# Altium schematic sheet Input Cover Flex.SchDoc
size B
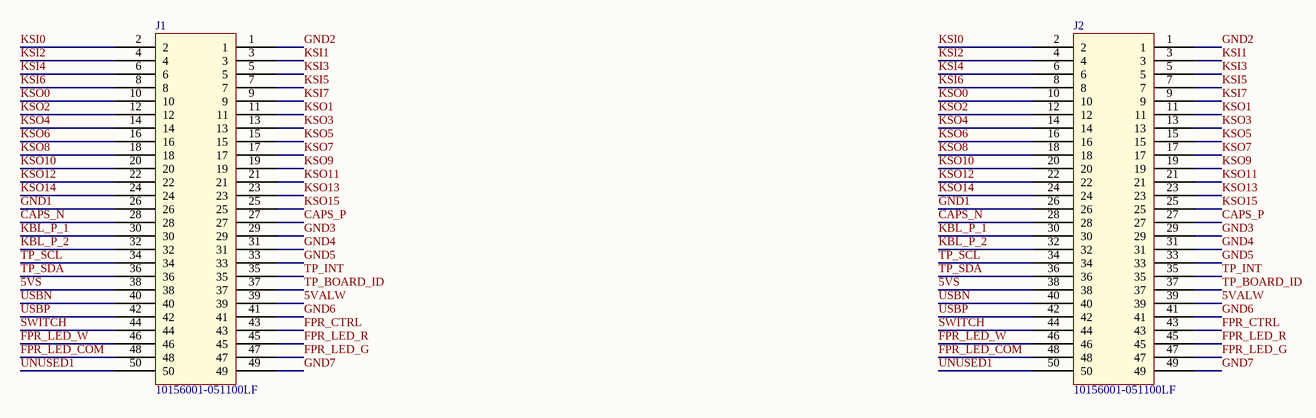
[diagram p0: Input Cover Flex.SchDoc]

## Parts
J1  10156001-051100LF  [10156001-051100LF]
J2  10156001-051100LF  [10156001-051100LF]

## Nets
5VALW: J1.39 J2.39
5VS: J1.38 J2.38
CAPS_N: J1.28 J2.28
CAPS_P: J1.27 J2.27
FPR_CTRL: J1.43 J2.43
FPR_LED_COM: J1.48 J2.48
FPR_LED_G: J1.47 J2.47
FPR_LED_R: J1.45 J2.45
FPR_LED_W: J1.46 J2.46
GND1: J1.26 J2.26
GND2: J1.1 J2.1
GND3: J1.29 J2.29
GND4: J1.31 J2.31
GND5: J1.33 J2.33
GND6: J1.41 J2.41
GND7: J1.49 J2.49
KBL_P_1: J1.30 J2.30
KBL_P_2: J1.32 J2.32
KSI0: J1.2 J2.2
KSI1: J1.3 J2.3
KSI2: J1.4 J2.4
KSI3: J1.5 J2.5
KSI4: J1.6 J2.6
KSI5: J1.7 J2.7
KSI6: J1.8 J2.8
KSI7: J1.9 J2.9
KSO0: J1.10 J2.10
KSO1: J1.11 J2.11
KSO2: J1.12 J2.12
KSO3: J1.13 J2.13
KSO4: J1.14 J2.14
KSO5: J1.15 J2.15
KSO6: J1.16 J2.16
KSO7: J1.17 J2.17
KSO8: J1.18 J2.18
KSO9: J1.19 J2.19
KSO10: J1.20 J2.20
KSO11: J1.21 J2.21
KSO12: J1.22 J2.22
KSO13: J1.23 J2.23
KSO14: J1.24 J2.24
KSO15: J1.25 J2.25
SWITCH: J1.44 J2.44
TP_BOARD_ID: J1.37 J2.37
TP_INT: J1.35 J2.35
TP_SCL: J1.34 J2.34
TP_SDA: J1.36 J2.36
UNUSED1: J1.50 J2.50
USBN: J1.40 J2.40
USBP: J1.42 J2.42